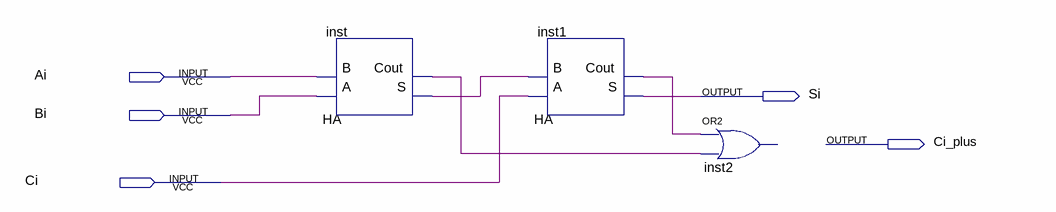
[diagram p0: schematic sheet]
// Quartus schematic FA.bdf as structural Verilog: 3 symbols, 5 pins
module FA (
  input  Ai,
  input  Bi,
  input  Ci,
  output Si,
  output Ci_plus
);

  wire inst1_cout, inst_cout, inst_s;

  HA inst (.A(Bi), .B(Ai), .S(inst_s), .Cout(inst_cout));
  HA inst1 (.A(Ci), .B(inst_s), .S(Si), .Cout(inst1_cout));
  // OR2 inst2 has open pins: IN1=inst1_cout, IN2=inst_cout, OUT=open
endmodule
